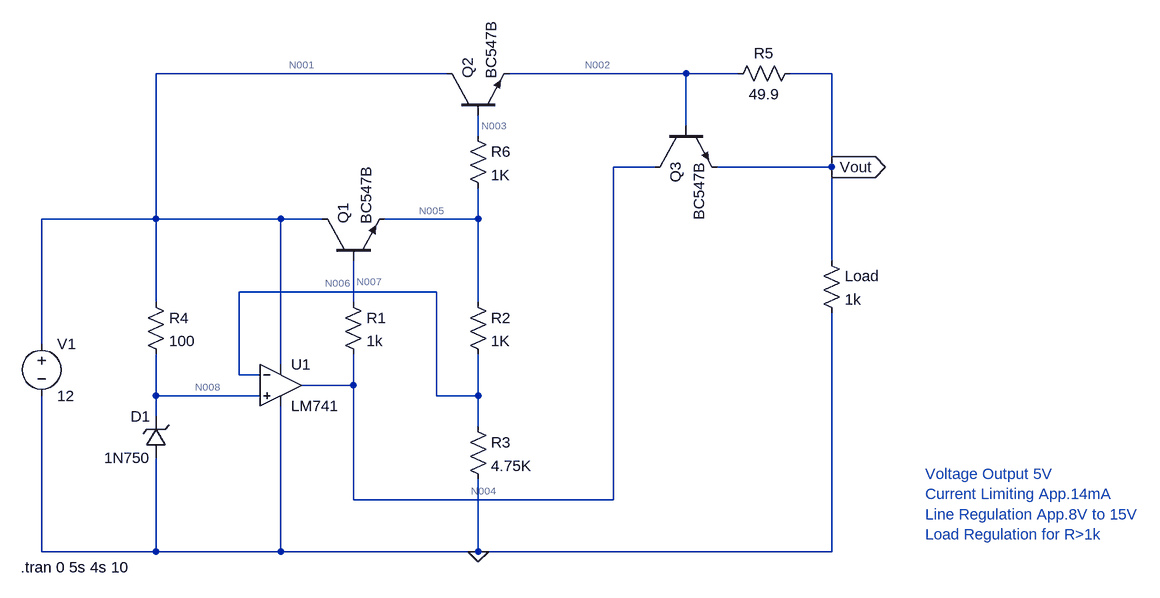
[diagram p0: schematic base.asc]
base.asc, the LTspice schematic file:
Version 4
SHEET 1 1700 680
WIRE 480 -320 32 -320
WIRE 848 -320 576 -320
WIRE 928 -320 848 -320
WIRE 1072 -320 1008 -320
WIRE 848 -240 848 -320
WIRE 528 -224 528 -256
WIRE 800 -176 736 -176
WIRE 1072 -176 1072 -320
WIRE 1072 -176 896 -176
WIRE 32 -96 32 -320
WIRE 32 -96 -144 -96
WIRE 224 -96 32 -96
WIRE 288 -96 224 -96
WIRE 528 -96 528 -144
WIRE 528 -96 384 -96
WIRE 1072 -32 1072 -176
WIRE 464 16 160 16
WIRE 32 32 32 -96
WIRE 336 32 336 -32
WIRE 528 32 528 -96
WIRE -144 96 -144 -96
WIRE 224 128 224 -96
WIRE 160 144 160 16
WIRE 192 144 160 144
WIRE 336 160 336 112
WIRE 336 160 256 160
WIRE 32 176 32 112
WIRE 192 176 32 176
WIRE 464 176 464 16
WIRE 528 176 528 112
WIRE 528 176 464 176
WIRE 32 208 32 176
WIRE 528 224 528 176
WIRE 336 336 336 160
WIRE 736 336 736 -176
WIRE 736 336 336 336
WIRE -144 416 -144 176
WIRE 32 416 32 272
WIRE 32 416 -144 416
WIRE 224 416 224 192
WIRE 224 416 32 416
WIRE 528 416 528 304
WIRE 528 416 224 416
WIRE 1072 416 1072 48
WIRE 1072 416 528 416
FLAG 528 416 0
FLAG 1072 -176 Vout
IOPIN 1072 -176 Out
SYMBOL OpAmps\\LM741 224 96 R0
SYMATTR InstName U1
SYMBOL res 320 16 R0
SYMATTR InstName R1
SYMATTR Value 1k
SYMATTR SpiceLine tol=1 pwr=0.1
SYMBOL res 512 16 R0
SYMATTR InstName R2
SYMATTR Value 1K
SYMATTR SpiceLine tol=1 pwr=0.1
SYMBOL res 512 208 R0
SYMATTR InstName R3
SYMATTR Value 4.75K
SYMATTR SpiceLine tol=1 pwr=0.1
SYMBOL res 16 16 R0
SYMATTR InstName R4
SYMATTR Value 100
SYMATTR SpiceLine tol=1 pwr=0.1
SYMBOL npn 288 -32 R270
SYMATTR InstName Q1
SYMATTR Value BC547B
SYMBOL zener 48 272 R180
WINDOW 0 24 64 Left 2
WINDOW 3 24 0 Left 2
SYMATTR InstName D1
SYMATTR Value 1N750
SYMBOL voltage -144 80 R0
WINDOW 123 0 0 Left 0
WINDOW 39 0 0 Left 0
SYMATTR InstName V1
SYMATTR Value 12
SYMBOL npn 480 -256 R270
SYMATTR InstName Q2
SYMATTR Value BC547B
SYMBOL res 512 -240 R0
SYMATTR InstName R6
SYMATTR Value 1K
SYMATTR SpiceLine tol=1 pwr=0.1
SYMBOL res 1024 -336 R90
WINDOW 0 0 56 VBottom 2
WINDOW 3 32 56 VTop 2
SYMATTR InstName R5
SYMATTR Value 49.9
SYMATTR SpiceLine tol=1 pwr=0.1
SYMBOL npn 800 -240 M90
SYMATTR InstName Q3
SYMATTR Value BC547B
SYMBOL res 1056 -48 R0
SYMATTR InstName Load
SYMATTR Value 1k
SYMATTR SpiceLine tol=1 pwr=0.1
TEXT -176 440 Left 2 !.tran 0 5s 4s 10
TEXT 1216 296 Left 2 ;Voltage Output 5V\nCurrent Limiting App.14mA\nLine Regulation App.8V to 15V\nLoad Regulation for R>1k

The netlist it stands for:
* base.asc
XU1 N008 N006 N001 0 N004 LM741  ; pins In+ In- V+ V- OUT
R1 N007 N004 1k tol=1 pwr=0.1
R2 N005 N006 1K tol=1 pwr=0.1
R3 N006 0 4.75K tol=1 pwr=0.1
R4 N001 N008 100 tol=1 pwr=0.1
Q1 N001 N007 N005 0 BC547B
D1 0 N008 1N750
V1 N001 0 12
Q2 N001 N003 N002 0 BC547B
R6 N003 N005 1K tol=1 pwr=0.1
R5 Vout N002 49.9 tol=1 pwr=0.1
Q3 N004 N002 Vout 0 BC547B
R§Load Vout 0 1k tol=1 pwr=0.1
.model D D
.lib standard.dio
.model NPN NPN
.model PNP PNP
.lib standard.bjt
.tran 0 5s 4s 10
* Voltage Output 5V
* Current Limiting App.14mA
* Line Regulation App.8V to 15V
* Load Regulation for R>1k
.lib LM741.lib
.backanno
.end

* Results of the author's LTspice run, read from the files saved beside the schematic
* Operating Point, zero values left out:
*   V(n006) = 4.774 V
*   V(n008) = 4.773 V
*   V(n001) = 12 V
*   V(n004) = 6.419 V
*   V(n007) = 6.416 V
*   V(n005) = 5.779 V
*   V(n003) = 5.763 V
*   V(n002) = 5.083 V
*   V(vout) = 4.841 V
*   Ic(Q1) = 1.018 mA
*   Ib(Q1) = 3.304 µA
*   Ie(Q1) = -1.021 mA
*   Ic(Q2) = 4.825 mA
*   Ib(Q2) = 15.88 µA
*   Ie(Q2) = -4.841 mA
*   Ic(Q3) = 257 pA
*   Ib(Q3) = 1.216 pA
*   Ie(Q3) = -258.2 pA
*   I(D1) = -72.27 mA
*   I(R1) = -3.304 µA
*   I(R2) = 1.005 mA
*   I(R3) = 1.005 mA
*   I(R4) = 72.27 mA
*   I(R6) = -15.88 µA
*   I(R5) = -4.841 mA
*   I(Load) = 4.841 mA
*   I(V1) = -79.59 mA
*   Ix(u1:1) = 57.95 nA
*   Ix(u1:2) = 101.8 nA
*   Ix(u1:99) = 1.478 mA
*   Ix(u1:50) = -1.475 mA
*   Ix(u1:28) = -3.304 µA